# EAGLE schematic mcu (EAGLE 6.4)
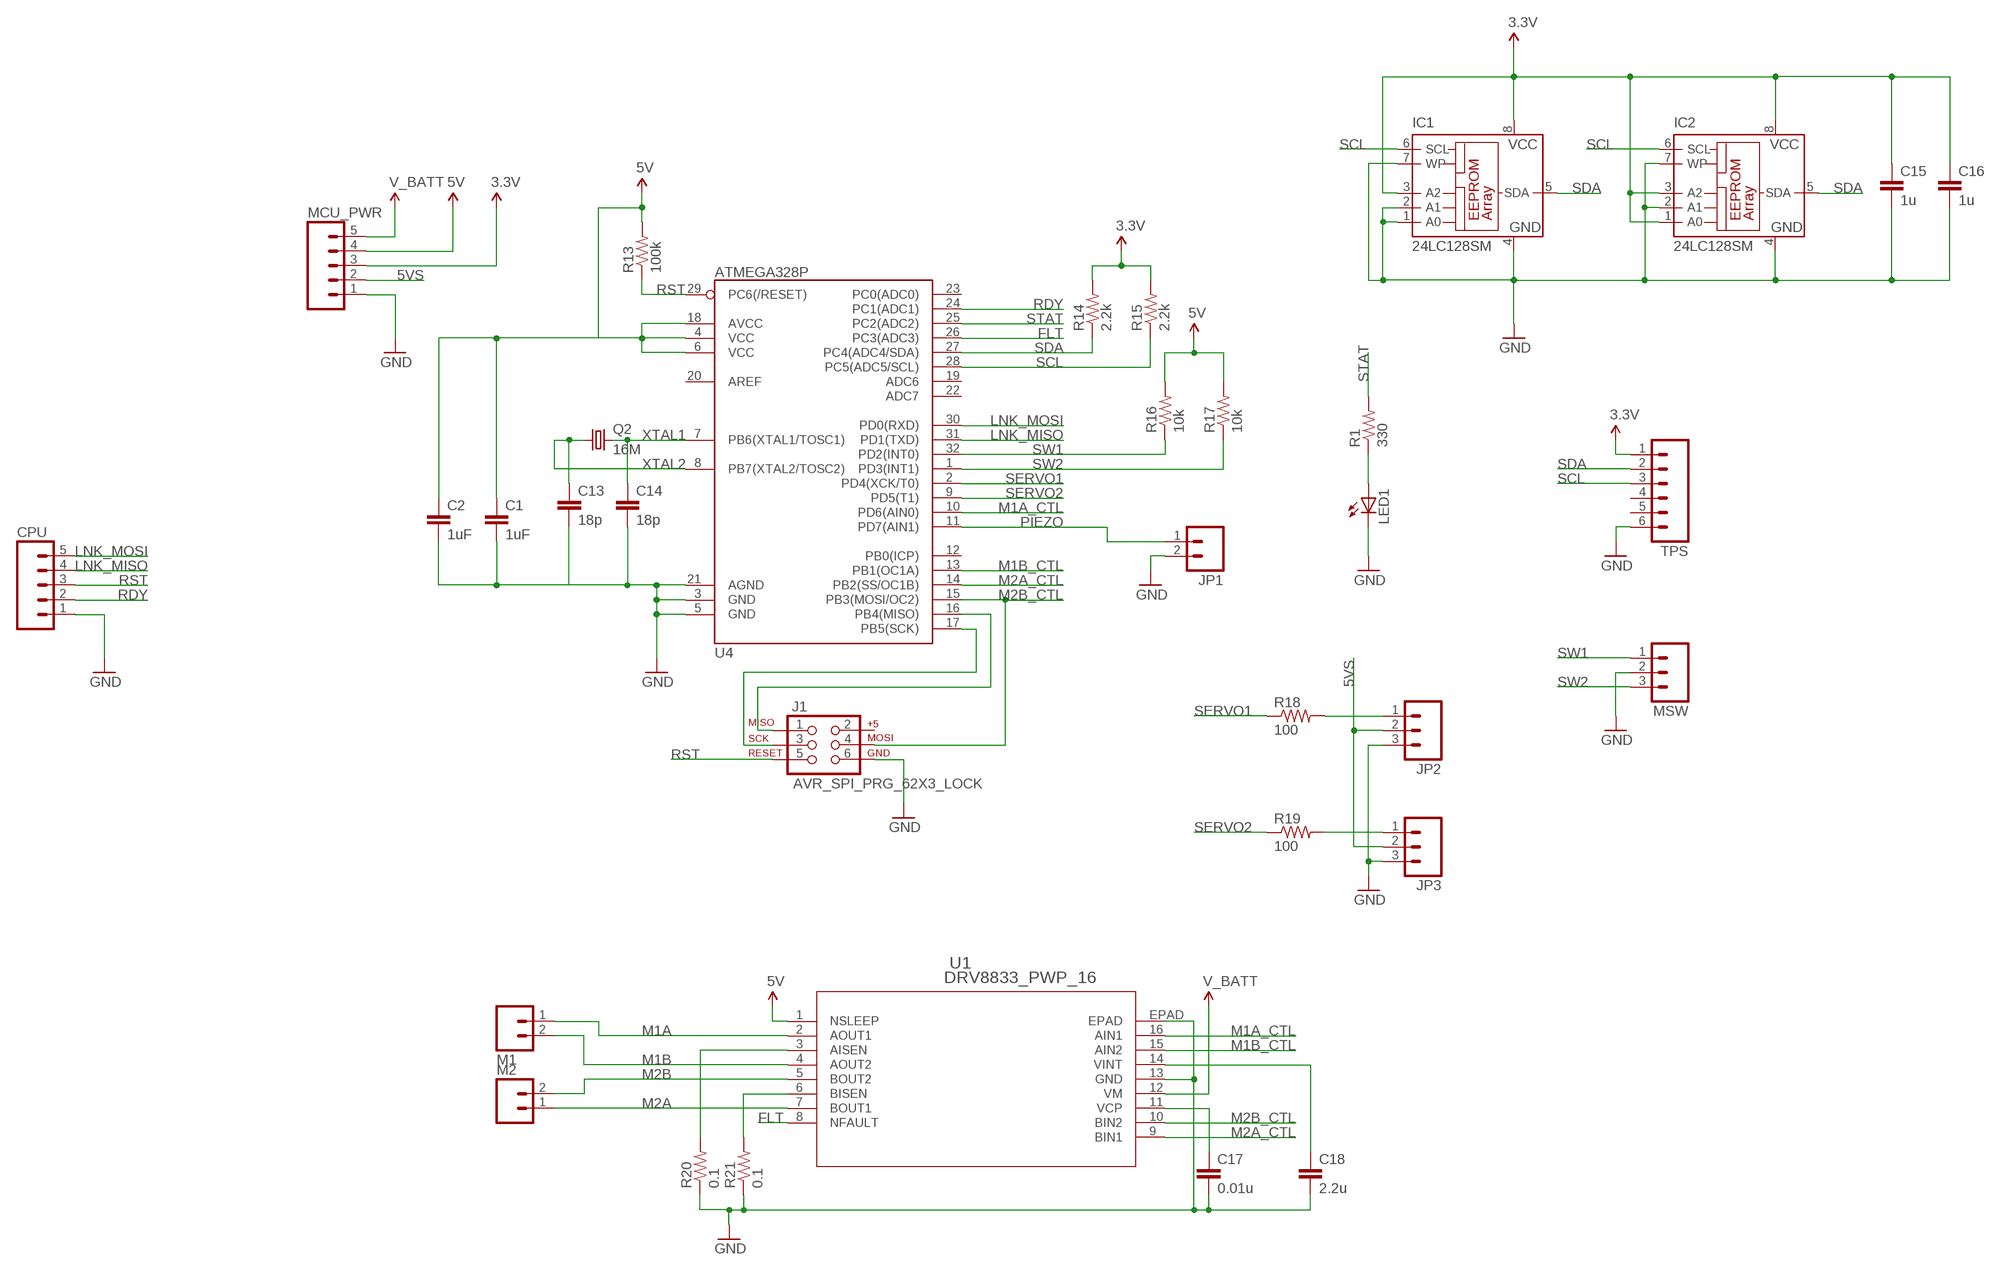
[diagram p0: schematic, sheet 1]

## Parts
C1  1uF  1UF-25V-10%(0805)  [0805]
C2  1uF  1UF-25V-10%(0805)  [0805]
C13  18p  CAP0805  [0805]
C14  18p  CAP0805  [0805]
C15  1u  CAP0805  [0805]
C16  1u  CAP0805  [0805]
C17  0.01u  CAP0805  [0805]
C18  2.2u  CAP0805  [0805]
CPU  M05PTH_LONGPADS  [1X05_LONGPADS]
IC1  24LC128SM  [SO-08M]
IC2  24LC128SM  [SO-08M]
J1  AVR_SPI_PRG_62X3_LOCK  [2X3_LOCK]
JP1  M02PTH3  [1X02_LONGPADS]
JP2  M03LOCK_LONGPADS  [1X03_LOCK_LONGPADS]
JP3  M03LOCK_LONGPADS  [1X03_LOCK_LONGPADS]
LED1  LED1206  [LED-1206]
M1  M02PTH3  [1X02_LONGPADS]
M2  M02PTH3  [1X02_LONGPADS]
MCU_PWR  M05PTH  [1X05]
MSW  M03LONGPADS  [1X03_LONGPADS]
Q2  16M  CRYSTALHC49UP  [HC49UP]
R1  330  RESISTOR0805-RES  [0805]
R13  100k  RESISTOR0805-RES  [0805]
R14  2.2k  RESISTOR0805-RES  [0805]
R15  2.2k  RESISTOR0805-RES  [0805]
R16  10k  RESISTOR0805-RES  [0805]
R17  10k  RESISTOR0805-RES  [0805]
R18  100  RESISTOR0805-RES  [0805]
R19  100  RESISTOR0805-RES  [0805]
R20  0.1  RESISTOR1206  [1206]
R21  0.1  RESISTOR1206  [1206]
TPS  M06LOCK  [1X06_LOCK]
U1  DRV8833_PWP_16  [PWP16_2P31X2P46]
U4  ATMEGA328P  ATMEGA328_SMT  [TQFP32-08]

## Nets
3.3V: C15.1 C16.1 IC1.3(A2) IC1.8(VCC) IC2.1(A0) IC2.3(A2) IC2.8(VCC) MCU_PWR.3 R14.2 R15.2 TPS.1
5V: C1.1 C2.1 MCU_PWR.4 R13.2 R16.2 R17.2 U1.1(NSLEEP) U4.4(VCC) U4.6(VCC) U4.18(AVCC)
5VS: JP2.2 JP3.2 MCU_PWR.2
FLT: U1.8(NFAULT) U4.26(PC3(ADC3))
GND: C1.2 C2.2 C13.2 C14.2 C15.2 C16.2 C17.2 C18.2 CPU.1 IC1.1(A0) IC1.2(A1) IC1.4(GND) IC1.7(WP) IC2.2(A1) IC2.4(GND) IC2.7(WP) J1.6 JP1.2 JP2.3 JP3.3 LED1.C MCU_PWR.1 MSW.2 R20.1 R21.1 TPS.6 U1.13(GND) U1.EPAD U4.3(GND) U4.5(GND) U4.21(AGND)
LNK_MISO: CPU.4 U4.31(PD1(TXD))
LNK_MOSI: CPU.5 U4.30(PD0(RXD))
M1A: M1.1 U1.2(AOUT1)
M1A_CTL: U1.16(AIN1) U4.10(PD6(AIN0))
M1B: M1.2 U1.4(AOUT2)
M1B_CTL: U1.15(AIN2) U4.13(PB1(OC1A))
M2A: M2.1 U1.7(BOUT1)
M2A_CTL: U1.9(BIN1) U4.14(PB2(SS/OC1B))
M2B: M2.2 U1.5(BOUT2)
M2B_CTL: J1.4 U1.10(BIN2) U4.15(PB3(MOSI/OC2))
N$1: LED1.A R1.1
N$17: JP2.1 R18.2
N$18: J1.3 U4.17(PB5(SCK))
N$19: J1.1 U4.16(PB4(MISO))
N$20: JP3.1 R19.2
N$21: C17.1 U1.11(VCP)
N$23: C18.1 U1.14(VINT)
N$24: R21.2 U1.6(BISEN)
N$25: R20.2 U1.3(AISEN)
PIEZO: JP1.1 U4.11(PD7(AIN1))
RDY: CPU.2 U4.24(PC1(ADC1))
RST: CPU.3 J1.5 R13.1 U4.29(PC6(/RESET))
SCL: IC1.6(SCL) IC2.6(SCL) R15.1 TPS.3 U4.28(PC5(ADC5/SCL))
SDA: IC1.5(SDA) IC2.5(SDA) R14.1 TPS.2 U4.27(PC4(ADC4/SDA))
SERVO1: R18.1 U4.2(PD4(XCK/T0))
SERVO2: R19.1 U4.9(PD5(T1))
STAT: R1.2 U4.25(PC2(ADC2))
SW1: MSW.1 R16.1 U4.32(PD2(INT0))
SW2: MSW.3 R17.1 U4.1(PD3(INT1))
V_BATT: MCU_PWR.5 U1.12(VM)
XTAL1: C14.1 Q2.2 U4.7(PB6(XTAL1/TOSC1))
XTAL2: C13.1 Q2.1 U4.8(PB7(XTAL2/TOSC2))
Unconnected: J1.2 TPS.4 TPS.5 U4.12(PB0(ICP)) U4.19(ADC6) U4.20(AREF) U4.22(ADC7) U4.23(PC0(ADC0))

## Library data of the parts
C1 C2 = SparkFun-Capacitors:1UF-25V-10%(0805): CAP-08064; PROD_ID: CAP-08064
C13-C18 = SparkFun-Passives:CAP: Capacitor Standard 0603 ceramic capacitor, and 0.1" leaded capacitor.
CPU MCU_PWR = SparkFun-Connectors:M05: Header 5 Standard 5-pin 0.1" header. Use with straight break away headers (SKU : PRT-00116), right angle break away headers (PRT-00553), swiss pins (PRT-00743), machine pins (PRT-00117), and female headers (PRT-00115). Molex polarized connector foot print use with SKU : PRT-08230 with associated crimp pins and housings.
IC1 IC2 = microchip:24*: Serial EEPROM I2C; MF: MICROCHIP; MPN: 24LC128-I/SM; OC_FARNELL: 9757937; OC_NEWARK: 92C7134
J1 = SparkFun-Connectors:AVR_SPI_PRG_6: AVR ISP 6 Pin This is the reduced ISP connector for AVR programming. Common on Arduino. This footprint will take up less PCB space and can be used with a 10-pin to 6-pin adapter such as SKU: BOB-08508
JP1 M1 M2 = SparkFun-Connectors:M02: Standard 2-pin 0.1" header. Use with - straight break away headers ( PRT-00116) - right angle break away headers (PRT-00553) - swiss pins (PRT-00743) - machine pins (PRT-00117) - female headers (PRT-00115) Molex polarized connector foot print use with: PRT-08233 with associated crimp pins and housings. 2.54_SCREWTERM for use with PRT-10571. 3.5mm Screw Terminal footprints for PRT-08084 5mm Screw Terminal footprints for use with PRT-08433
JP2 JP3 MSW = SparkFun-Connectors:M03: Header 3 Standard 3-pin 0.1" header. Use with straight break away headers (SKU : PRT-00116), right angle break away headers (PRT-00553), swiss pins (PRT-00743), machine pins (PRT-00117), and female headers (PRT-00115). Molex polarized connector foot print use with SKU : PRT-08232 with associated crimp pins and housings.
LED1 = SparkFun-LED:LED: LEDs Standard schematic elements and footprints for 5mm, 3mm, 1206, and 0603 sized LEDs. 5mm - Spark Fun Electronics SKU : COM-00529 (and others)
Q2 = crystal:CRYSTAL: CRYSTAL; OC_FARNELL: unknown; OC_NEWARK: unknown
R1 R13-R21 = SparkFun-Passives:RESISTOR: Resistor Basic schematic elements and footprints for 0603, 1206, and PTH resistors.
TPS = SparkFun-Connectors:M06: Header 6 Standard 6-pin 0.1" header. Use with straight break away headers (SKU : PRT-00116), right angle break away headers (PRT-00553), swiss pins (PRT-00743), machine pins (PRT-00117), and female headers (PRT-00115). Molex polarized connector foot print use with SKU : PRT-08094 with associated crimp pins and housings. NOTES ON THE VARIANTS LOCK and LOCK_LONGPADS... This footprint was designed to help hold the alignment of a through-hole component (i.e. 6-pin header) while soldering it into place. You may notice that each hole has been shifted either up or down by 0.005 of an inch from it's more standard position (which is a perfectly straight line). This slight alteration caused the pins (the squares in the middle) to touch the edges of the holes. Because they are alternating, it causes a "brace" to hold the component in place. 0.005 has proven to be the perfect amount of "off-center" position when using our standard breakaway headers. Although looks a little odd when you look at the bare footprint, once you have a header in there, the alteration is very hard to notice. Also,if you push a header all the way into place, it is covered up entirely on the bottom side. This idea of altering the position of holes to aid alignment will be further integrated into the Sparkfun Library for other footprints. It can help hold any component with 3 or more connection pins.
U1 = L5973D:DRV8833_PWP_16; DATASHEETURL: http://www.ti.com/lit/gpn/DRV8833; DESCRIPTION: 2A Low Voltage Dual Brushed DC or Single Bipolar Stepper Motor Driver (PWM Ctrl); FAMILY_NAME: BRUSHED DC DRIVER; GENERIC_PART_NUMBER: DRV8833; INDUSTRY_STD_PKG_TYPE: HTSSOP; MANUFACTURER: Texas Instruments; MANUFACTURER_PART_NUMBER: drv8833_pwp_16; PACKAGE_DESIGNATOR: PWP; PIN_COUNT: 16; VENDOR: Texas Instruments
U4 = SparkFun-DigitalIC:ATMEGA328_SMT: 32-Pin Atmega328 part Commonly used on Arduino compatible boards Available in QFP and QFN packages TQFP is IC-09069 QFN is non-stock; PROD_ID: IC-09069